# Altium schematic sheet CPU.SchDoc
size A3
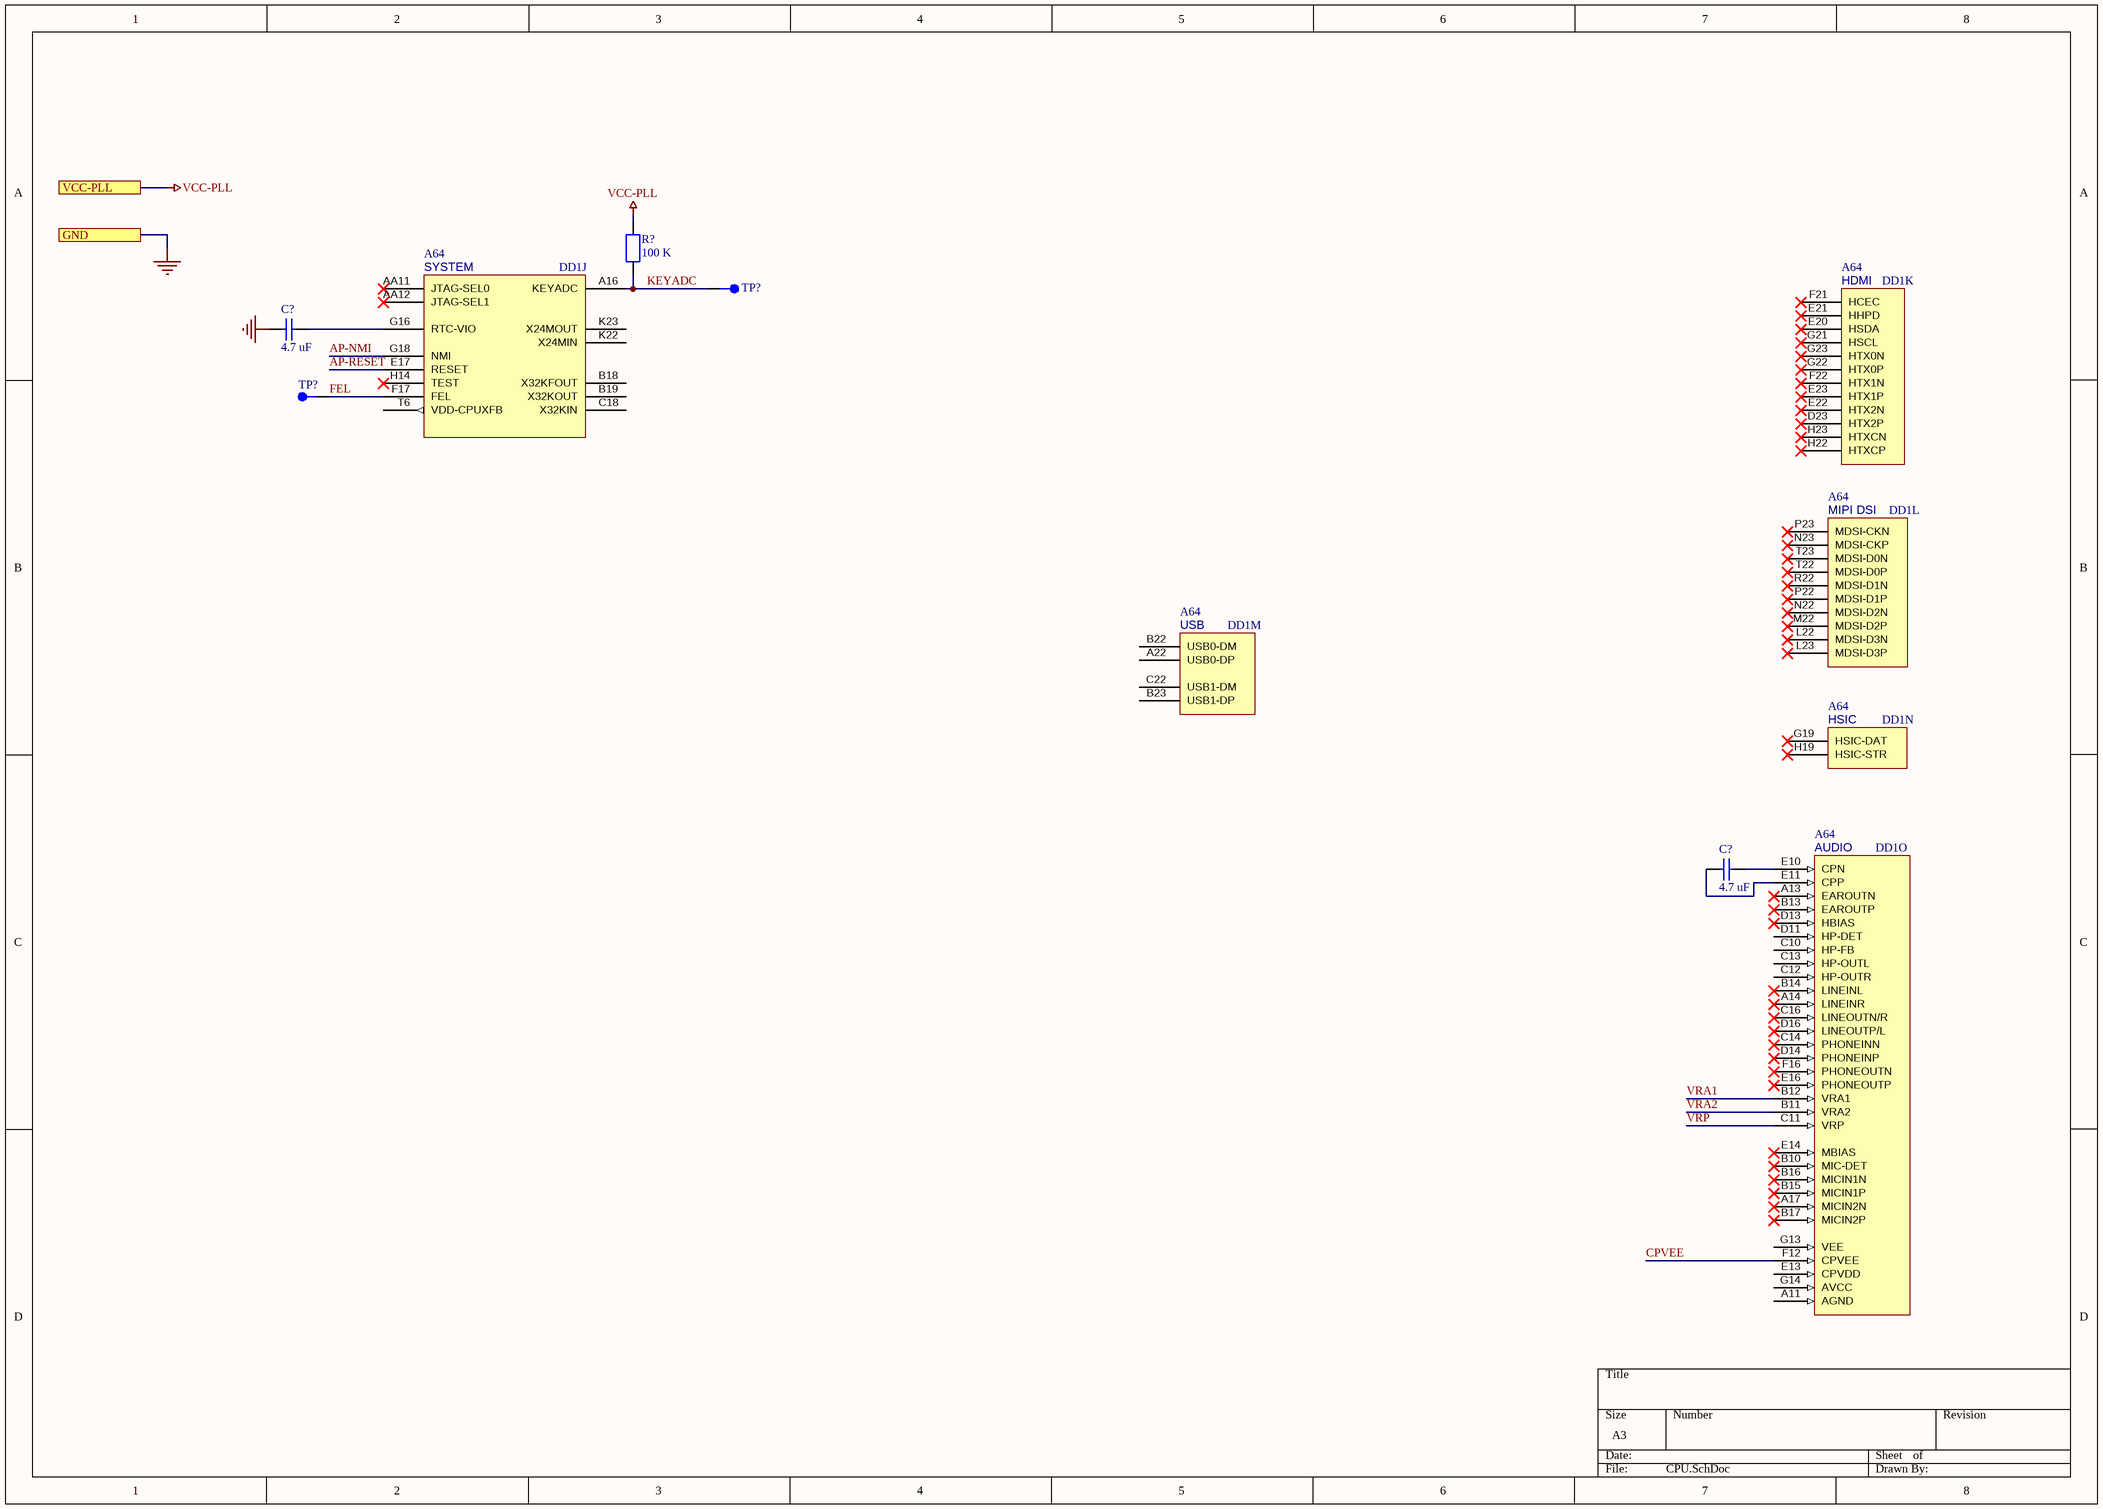
[diagram p0: CPU.SchDoc]

## Parts
(Parts that share a designator on the sheet are numbered #1, #2 ... from top to bottom, then left to right.)
C?#1  4.7 uF  [CAPC1608X80N]
C?#2  4.7 uF  [CAPC1608X80N]
DD1  A64  [BGA396C65P23X23_1500X1500X130]  (parts J,K,L,M,N,O of 16)
R?  100 K  [RESC1005X40N]
TP?#1  (no value)  [TP_ASSY_PAD_13]  (no BOM)
TP?#2  (no value)  [TP_ASSY_PAD_13]  (no BOM)

## Ports
GND, VCC-PLL

## Nets
GND: C?#1.1 ; port GND
VCC-PLL: R?.2 ; port VCC-PLL
AP-NMI: DD1.G18(NMI)
AP-RESET: DD1.E17(RESET)
CPVEE: DD1.F12(CPVEE)
FEL: DD1.F17(FEL) TP?#2.1
KEYADC: DD1.A16(KEYADC) R?.1 TP?#1.1
VRA1: DD1.B12(VRA1)
VRA2: DD1.B11(VRA2)
VRP: DD1.C11(VRP)
NetC?#1_2: C?#1.2 DD1.G16(RTC-VIO)
NetC?#2_1: C?#2.1 DD1.E11(CPP)
NetC?#2_2: C?#2.2 DD1.E10(CPN)

Not connected (* = marked no-connect by the designer): DD1 A11(AGND) A13(EAROUTN)* A14(LINEINR)* A17(MICIN2N)* A22(USB0-DP) AA11(JTAG-SEL0)* AA12(JTAG-SEL1)* B10(MIC-DET)* B13(EAROUTP)* B14(LINEINL)* B15(MICIN1P)* B16(MICIN1N)* B17(MICIN2P)* B18(X32KFOUT) B19(X32KOUT) B22(USB0-DM) B23(USB1-DP) C10(HP-FB) C12(HP-OUTR) C13(HP-OUTL) C14(PHONEINN)* C16(LINEOUTN/R)* C18(X32KIN) C22(USB1-DM) D11(HP-DET) D13(HBIAS)* D14(PHONEINP)* D16(LINEOUTP/L)* D23(HTX2P)* E13(CPVDD) E14(MBIAS)* E16(PHONEOUTP)* E20(HSDA)* E21(HHPD)* E22(HTX2N)* E23(HTX1P)* F16(PHONEOUTN)* F21(HCEC)* F22(HTX1N)* G13(VEE) G14(AVCC) G19(HSIC-DAT)* G21(HSCL)* G22(HTX0P)* G23(HTX0N)* H14(TEST)* H19(HSIC-STR)* H22(HTXCP)* H23(HTXCN)* K22(X24MIN) K23(X24MOUT) L22(MDSI-D3N)* L23(MDSI-D3P)* M22(MDSI-D2P)* N22(MDSI-D2N)* N23(MDSI-CKP)* P22(MDSI-D1P)* P23(MDSI-CKN)* R22(MDSI-D1N)* T6(VDD-CPUXFB) T22(MDSI-D0P)* T23(MDSI-D0N)*

## Notes on the sheet
- (in symbol A64, part J) SYSTEM
- (in symbol A64, part K) HDMI
- (in symbol A64, part L) MIPI DSI
- (in symbol A64, part M) USB
- (in symbol A64, part N) HSIC
- (in symbol A64, part O) AUDIO

## Library data of the parts
C?#1 C?#2 = CAP-0044: CAP CER 4.7UF 16V X5R 0603; Manufacturer: Yageo; Manufacturer Part Number: CC0603KRX5R7BB475; Tolerance: ±10%; Type: Capacitors; Unique Id: CAP-0044; Voltage: 16 V; Author: Derstuganov; Case: 0603; Category: MLCC; ComponentLink1Description: Datasheet; ComponentLink1URL: https://www.yageo.com/upload/media/product/productsearch/datasheet/mlcc/UPY-GPHC_X5R_4V-to-50V_25.pdf; TC: X5R; Temperature: -55°C to 85°C; Termination style: SMD; Value: 4.7 uF; Status: Draft
DD1 = A64: 4xA53
R? = RES-0019: RES SMD 100K OHM 1% 1/16W 0402; Manufacturer: Yageo; Manufacturer Part Number: RC0402FR-07100KL; TC: ±100ppm/°C; Power: 0.063 W; Unique Id: RES-0019; Author: Laptev; Case: 0402; Category: Film; ComponentLink1Description: Datasheet; ComponentLink1URL: https://www.yageo.com/upload/media/product/productsearch/datasheet/rchip/PYu-RC_Group_51_RoHS_L_10.pdf; Temperature: -55°C to 155°C; Termination style: SMD; Tolerance: ±1%; Value: 100 K; Status: Draft; Type: Resistors
TP?#1 TP?#2 = EM-0002: Assembly Testpoint PAD 1.3mm; Unique Id: EM-0002; Author: Laptev; Case: SMD-1; Category: Testpoint; Termination style: SMD; Status: Draft; Type: Electro Mechanicals